# EAGLE schematic digital lockin_LOOK_AT_THIS (EAGLE 9.6.2)

## Sheet 1 of 2
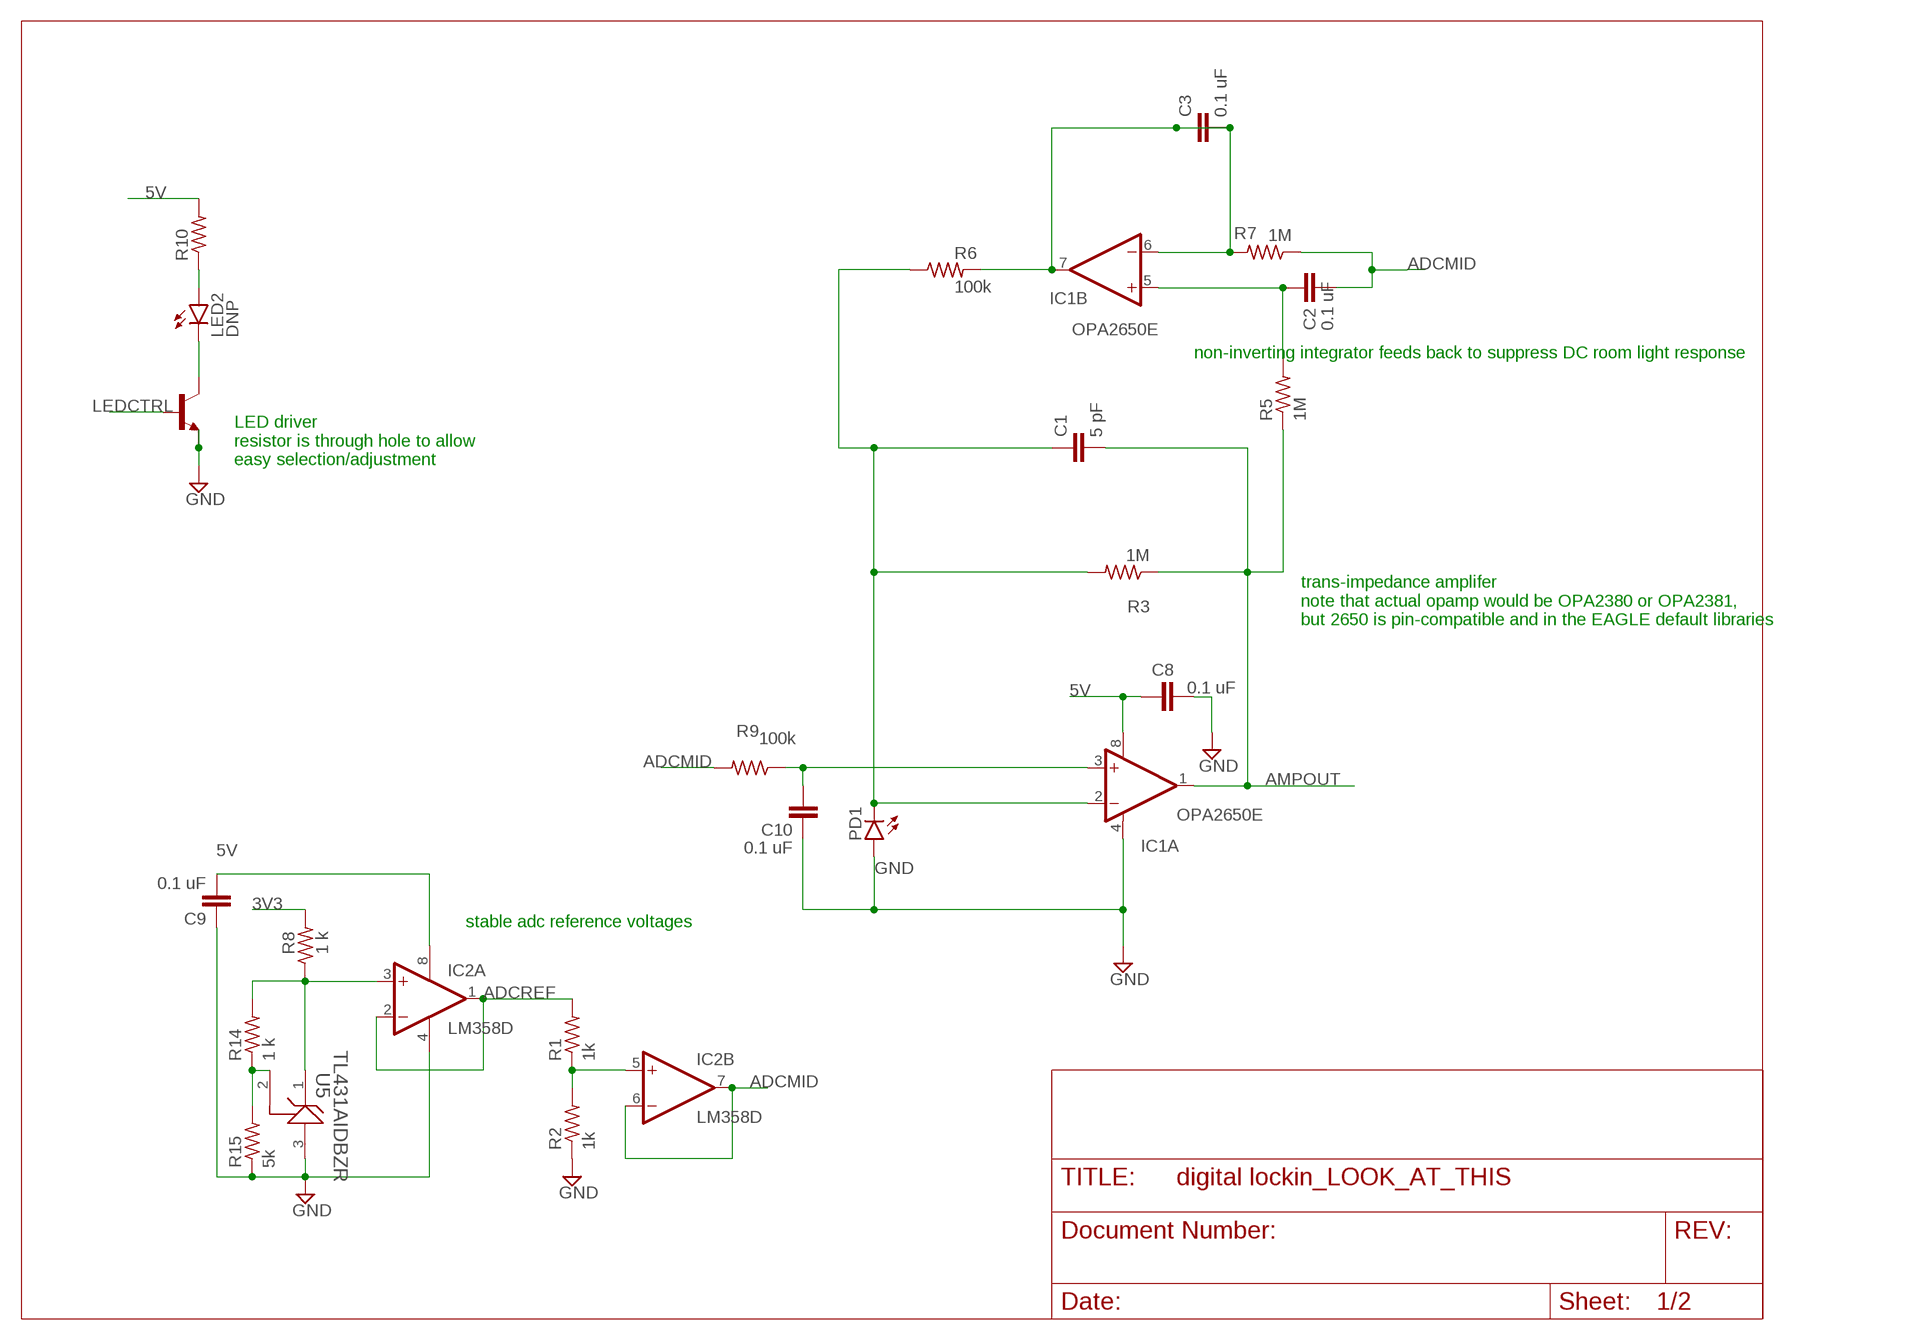
[diagram p0: schematic, sheet 1]

### Parts
C1  5 pF  C-EUC0805  [C0805]
C2  0.1 uF  C-EUC0805  [C0805]
C3  0.1 uF  C-EUC0805  [C0805]
C8  0.1 uF  C-EUC0805  [C0805]
C9  0.1 uF  C-EUC0805  [C0805]
C10  0.1 uF  C-EUC0805  [C0805]
IC1  OPA2650E  [MSOP08]
IC2  LM358D  [SO08]
LED2  DNP  LED5MM  [LED5MM]
PD1  DNP  LED5MM  [LED5MM]
R1  1k  R-US_R0805  [R0805]
R2  1k  R-US_R0805  [R0805]
R3  1M  R-US_R0805  [R0805]
R5  1M  R-US_R0805  [R0805]
R6  100k  R-US_R0805  [R0805]
R7  1M  R-US_R0805  [R0805]
R8  1 k  R-US_R0805  [R0805]
R9  100k  R-US_R0805  [R0805]
R10  DNP  R-US_0204/2V  [0204V]
R14  1 k  R-US_R0805  [R0805]
R15  5k  R-US_R0805  [R0805]
T2  NPN  BC808-NPN-SOT23-BEC  [SOT23-BEC]
U5  TL431AIDBZR  [DBZ0003A_N]

### Nets
3V3 [power]: R8.2 ; also sheet 2
5V [power]: C8.1 C9.2 IC1.8(A:V+) IC2.8(P:V+) R10.2 ; also sheet 2
ADCMID: C2.2 IC2.6(B:-IN) IC2.7(B:OUT) R7.1 R9.2 ; also sheet 2
ADCREF: IC2.1(A:OUT) IC2.2(A:-IN) R1.2 ; also sheet 2
AMPOUT: C1.2 IC1.1(A:OUT) R3.1 R5.1 ; also sheet 2
GND [power]: C8.2 C9.1 C10.1 IC1.4(A:V-) IC2.4(P:V-) PD1.A R2.1 R15.1 T2.E U5.3(ANODE) ; also sheet 2
LEDCTRL: T2.B ; also sheet 2
N$1: C3.1 C3.2 IC1.6(B:-IN) IC1.7(B:OUT) R6.2 R7.2
N$2: C2.1 IC1.5(B:+IN) R5.2
N$3: LED2.K(C) T2.C
N$5: C1.1 IC1.2(A:-IN) PD1.K(C) R3.2 R6.1
N$7: C10.2 IC1.3(A:+IN) R9.1
N$9: IC2.3(A:+IN) R8.1 R14.2 U5.1(CATHODE)
N$10: IC2.5(B:+IN) R1.1 R2.2
N$12: LED2.A R10.1
N$20: R14.1 R15.2 U5.2(REF)

### Notes on the sheet
- non-inverting integrator feeds back to suppress DC room light response
- LED driver
  resistor is through hole to allow 
  easy selection/adjustment
- trans-impedance amplifer
  note that actual opamp would be OPA2380 or OPA2381, 
  but 2650 is pin-compatible and in the EAGLE default libraries
- stable adc reference voltages

## Sheet 2 of 2
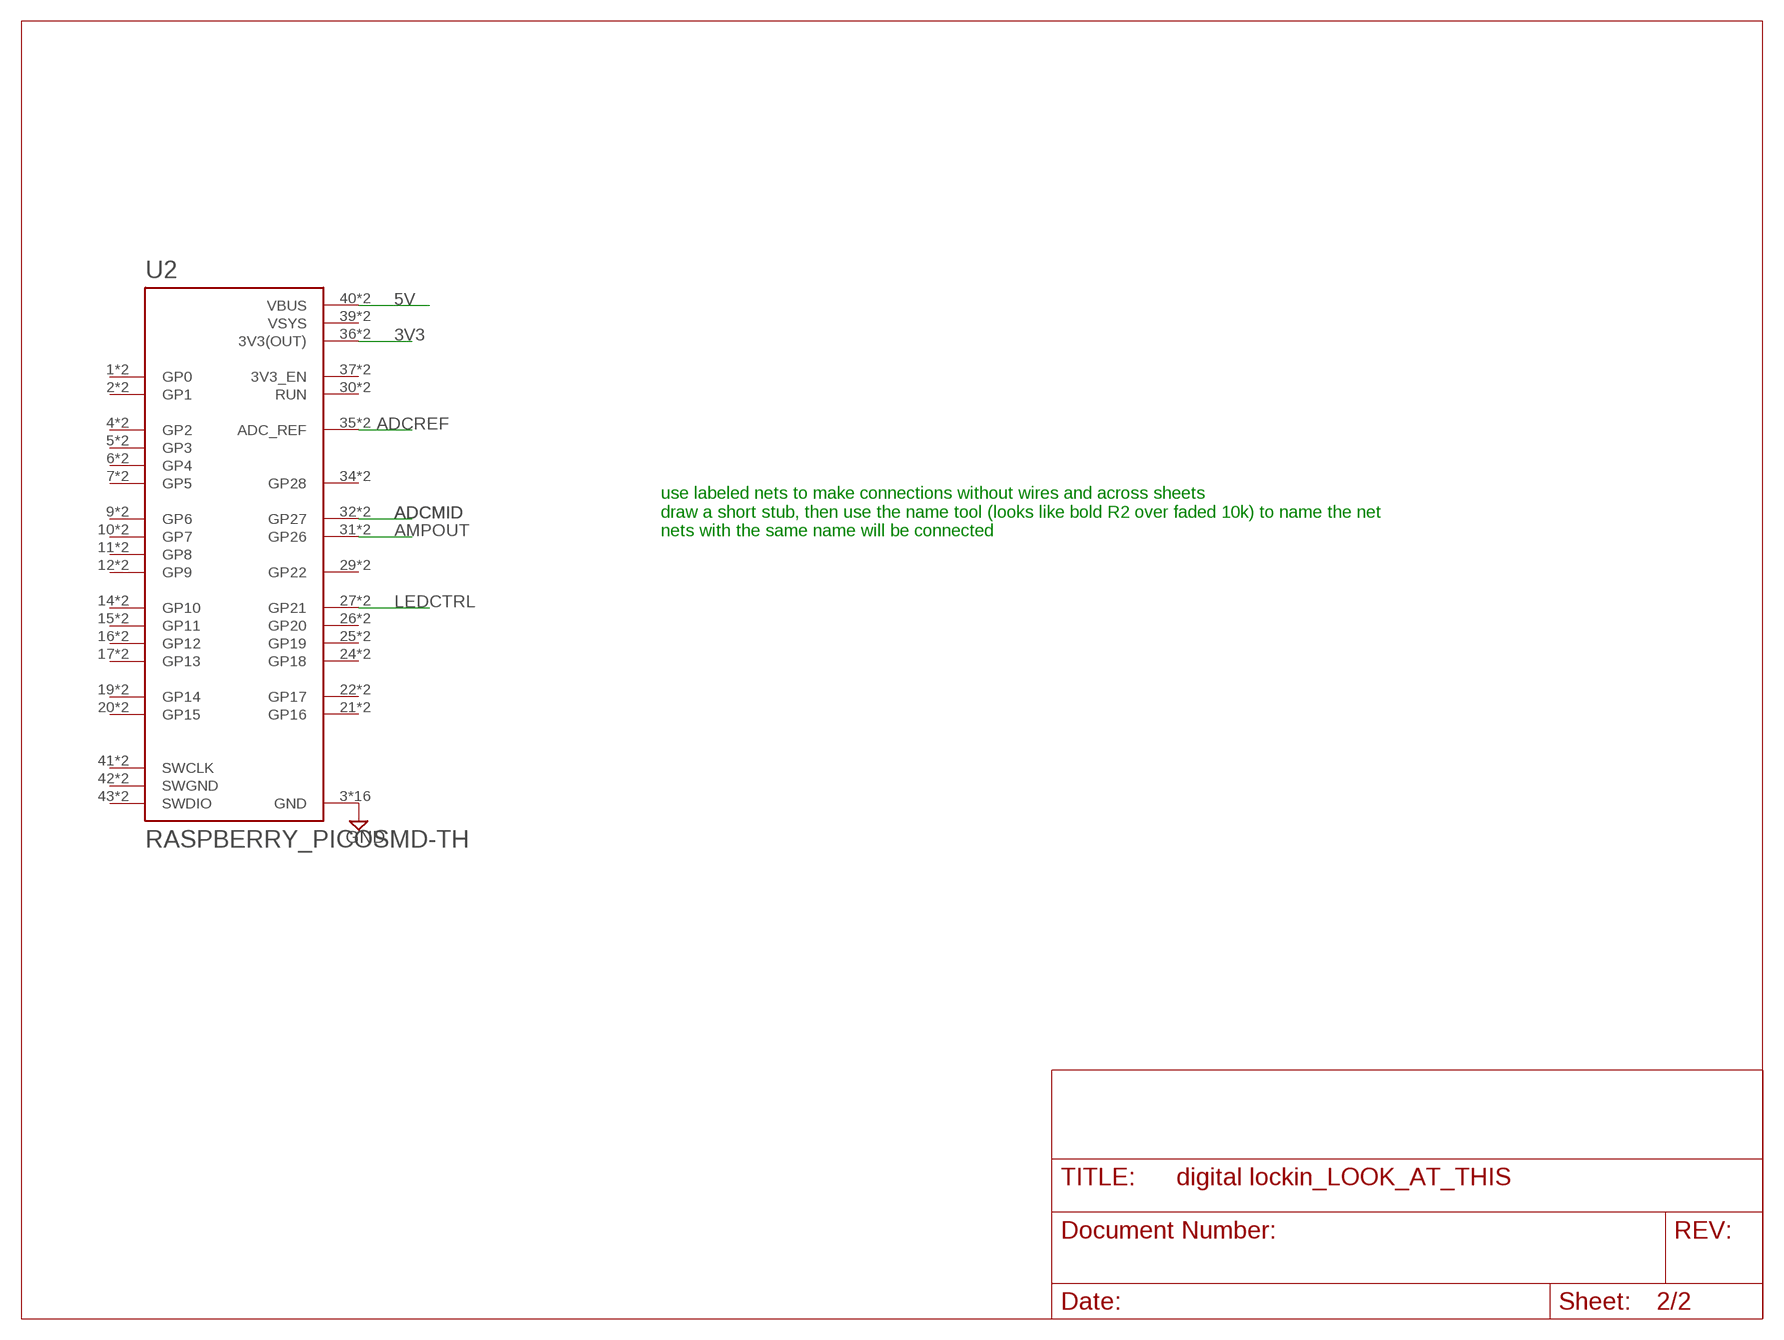
[diagram p1: schematic, sheet 2]

### Parts
U2  RASPBERRY_PICOSMD-TH  [PICO-PKG]

### Nets
3V3 [power]: U2.36(3V3(OUT)) U2.P$36(3V3(OUT)) ; also sheet 1
5V [power]: U2.40(VBUS) U2.P$40(VBUS) ; also sheet 1
ADCMID: U2.32(GP27) U2.P$32(GP27) ; also sheet 1
ADCREF: U2.35(ADC_REF) U2.P$35(ADC_REF) ; also sheet 1
AMPOUT: U2.31(GP26) U2.P$31(GP26) ; also sheet 1
GND [power]: U2.3(GND) U2.8(GND) U2.13(GND) U2.18(GND) U2.23(GND) U2.28(GND) U2.33(GND) U2.38(GND) U2.P$3(GND) U2.P$8(GND) U2.P$13(GND) U2.P$18(GND) U2.P$23(GND) U2.P$28(GND) U2.P$33(GND) U2.P$38(GND) ; also sheet 1
LEDCTRL: U2.27(GP21) U2.P$27(GP21) ; also sheet 1
Unconnected: U2.1(GP0) U2.2(GP1) U2.4(GP2) U2.5(GP3) U2.6(GP4) U2.7(GP5) U2.9(GP6) U2.10(GP7) U2.11(GP8) U2.12(GP9) U2.14(GP10) U2.15(GP11) U2.16(GP12) U2.17(GP13) U2.19(GP14) U2.20(GP15) U2.21(GP16) U2.22(GP17) U2.24(GP18) U2.25(GP19) U2.26(GP20) U2.29(GP22) U2.30(RUN) U2.34(GP28) U2.37(3V3_EN) U2.41(SWCLK) U2.43(SWDIO) U2.P$1(GP0) U2.P$2(GP1) U2.P$4(GP2) U2.P$5(GP3) U2.P$6(GP4) U2.P$7(GP5) U2.P$9(GP6) U2.P$10(GP7) U2.P$11(GP8) U2.P$12(GP9) U2.P$14(GP10) U2.P$15(GP11) U2.P$16(GP12) U2.P$17(GP13) U2.P$19(GP14) U2.P$20(GP15) U2.P$21(GP16) U2.P$22(GP17) U2.P$24(GP18) U2.P$25(GP19) U2.P$26(GP20) U2.P$29(GP22) U2.P$30(RUN) U2.P$34(GP28) U2.P$37(3V3_EN) U2.P$41(SWCLK) U2.P$43(SWDIO)

### Notes on the sheet
- use labeled nets to make connections without wires and across sheets
  draw a short stub, then use the name tool (looks like bold R2 over faded 10k) to name the net
  nets with the same name will be connected

## Power pins joined to a net without a drawn wire
SWGND: U2.42(SWGND) U2.P$42(SWGND)
VSYS: U2.39(VSYS) U2.P$39(VSYS)

## Library data of the parts
C1 = rcl:C-EU: CAPACITOR, European symbol; SPICEPREFIX: C
C2 C3 C8-C10 = rcl:C-EU: CAPACITOR, European symbol; LCSC_PART#: C28233; SPICEPREFIX: C
IC1 = burr-brown:OPA2650: Dual Wideband, Low Power Voltage Feedback Operational Amplifier; ACTUAL_PART: OPA2381; LCSC_PART#: C181662; OC_FARNELL: unknown; OC_NEWARK: unknown
IC2 = linear:LM358: OP AMP also LM158; LM258; LM2904 Source: http://cache.national.com/ds/LM/LM158.pdf; LCSC_PART#: C7950
LED2 PD1 = led:LED: LED OSRAM: - CHIPLED LG R971, LG N971, LY N971, LG Q971, LY Q971, LO R971, LY R971 LH N974, LH R974 LS Q976, LO Q976, LY Q976 LO Q996 - Hyper CHIPLED LW Q18S LB Q993, LB Q99A, LB R99A - SideLED LS A670, LO A670, LY A670, LG A670, LP A670 LB A673, LV A673, LT A673, LW A673 LH A674 LY A675 LS A676, LA A676, LO A676, LY A676, LW A676 LS A679, LY A679, LG A679 - Hyper Micro SIDELED® LS Y876, LA Y876, LO Y876, LY Y876 LT Y87S - SmartLED LW L88C, LW L88S LB L89C, LB L89S, LG L890 LS L89K, LO L89K, LY L89K LS L896, LA L896, LO L896, LY L896 - TOPLED LS T670, LO T670, LY T670, LG T670, LP T670 LSG T670, LSP T670, LSY T670, LOP T670, LYG T670 LG T671, LOG T671, LSG T671 LB T673, LV T673, LT T673, LW T673 LH T674 LS T676, LA T676, LO T676, LY T676, LB T676, LH T676, LSB T676, LW T676 LB T67C, LV T67C, LT T67C, LS T67K, LO T67K, LY T67K, LW E67C LS E67B, LA E67B, LO E67B, LY E67B, LB E67C, LV E67C, LT E67C LW T67C LS T679, LY T679, LG T679 LS T770, LO T770, LY T770, LG T770, LP T770 LB T773, LV T773, LT T773, LW T773 LH T774 LS E675, LA E675, LY E675, LS T675 LS T776, LA T776, LO T776, LY T776, LB T776 LHGB T686 LT T68C, LB T68C - Hyper Mini TOPLED® LB M676 - Mini TOPLED Santana® LG M470 LS M47K, LO M47K, LY M47K Source: http://www.osram.convergy.de LUXEON: - LUMILED® LXK2-PW12-R00, LXK2-PW12-S00, LXK2-PW14-U00, LXK2-PW14-V00 LXK2-PM12-R00, LXK2-PM12-S00, LXK2-PM14-U00 LXK2-PE12-Q00, LXK2-PE12-R00, LXK2-PE12-S00, LXK2-PE14-T00, LXK2-PE14-U00 LXK2-PB12-K00, LXK2-PB12-L00, LXK2-PB12-M00, LXK2-PB14-N00, LXK2-PB14-P00, LXK2-PB14-Q00 LXK2-PR12-L00, LXK2-PR12-M00, LXK2-PR14-Q00, LXK2-PR14-R00 LXK2-PD12-Q00, LXK2-PD12-R00, LXK2-PD12-S00 LXK2-PH12-R00, LXK2-PH12-S00 LXK2-PL12-P00, LXK2-PL12-Q00, LXK2-PL12-R00 Source: www.luxeon.com KINGBRIGHT: KA-3528ASYC Source: www.kingbright.com
R1 R2 R8 R14 = rcl:R-US_: RESISTOR, American symbol; LCSC_PART#: C17513; SPICEPREFIX: R
R3 R5 R7 = rcl:R-US_: RESISTOR, American symbol; LCSC_PART#: C17514; SPICEPREFIX: R
R6 R9 = rcl:R-US_: RESISTOR, American symbol; LCSC_PART#: C149504; SPICEPREFIX: R
R10 R15 = rcl:R-US_: RESISTOR, American symbol; SPICEPREFIX: R
T2 = transistor:*-NPN-: NPN Transistror BF959 corrected 2008.03.06; LCSC_PART#: C2145
U2 = RpiPico:RASPBERRY_PICO: Raspberry Pi Pico
U5 = tl431:TL431AIDBZR; COPYRIGHT: Copyright (C) 2025 Ultra Librarian. All rights reserved.; LCSC_PART#: C3113; MANUFACTURER_PART_NUMBER: TL431AIDBZR; MFR_NAME: Texas Instruments; REFDES: RefDes; TYPE: TYPE

## Net classes
1 power: width 0.305 mm